# Altium schematic sheet G4-Coral.SchDoc
size A2; Author: Bohao Chu; SheetNumber: 4; SheetTotal: 4
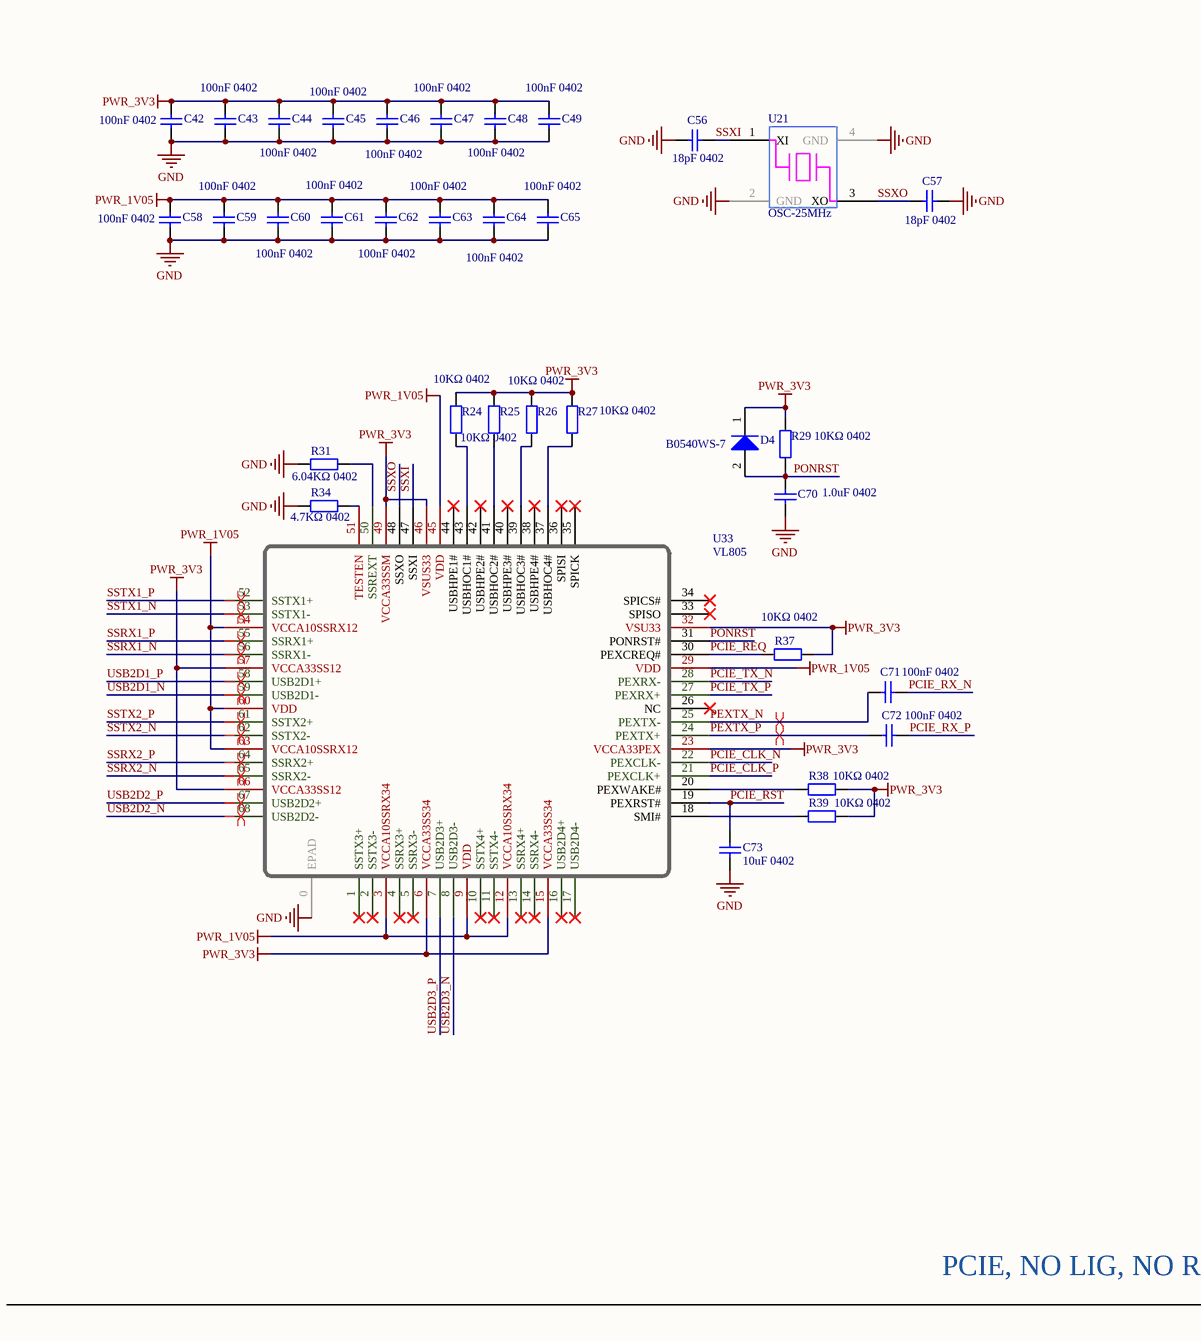
[diagram p0: G4-Coral.SchDoc, left]
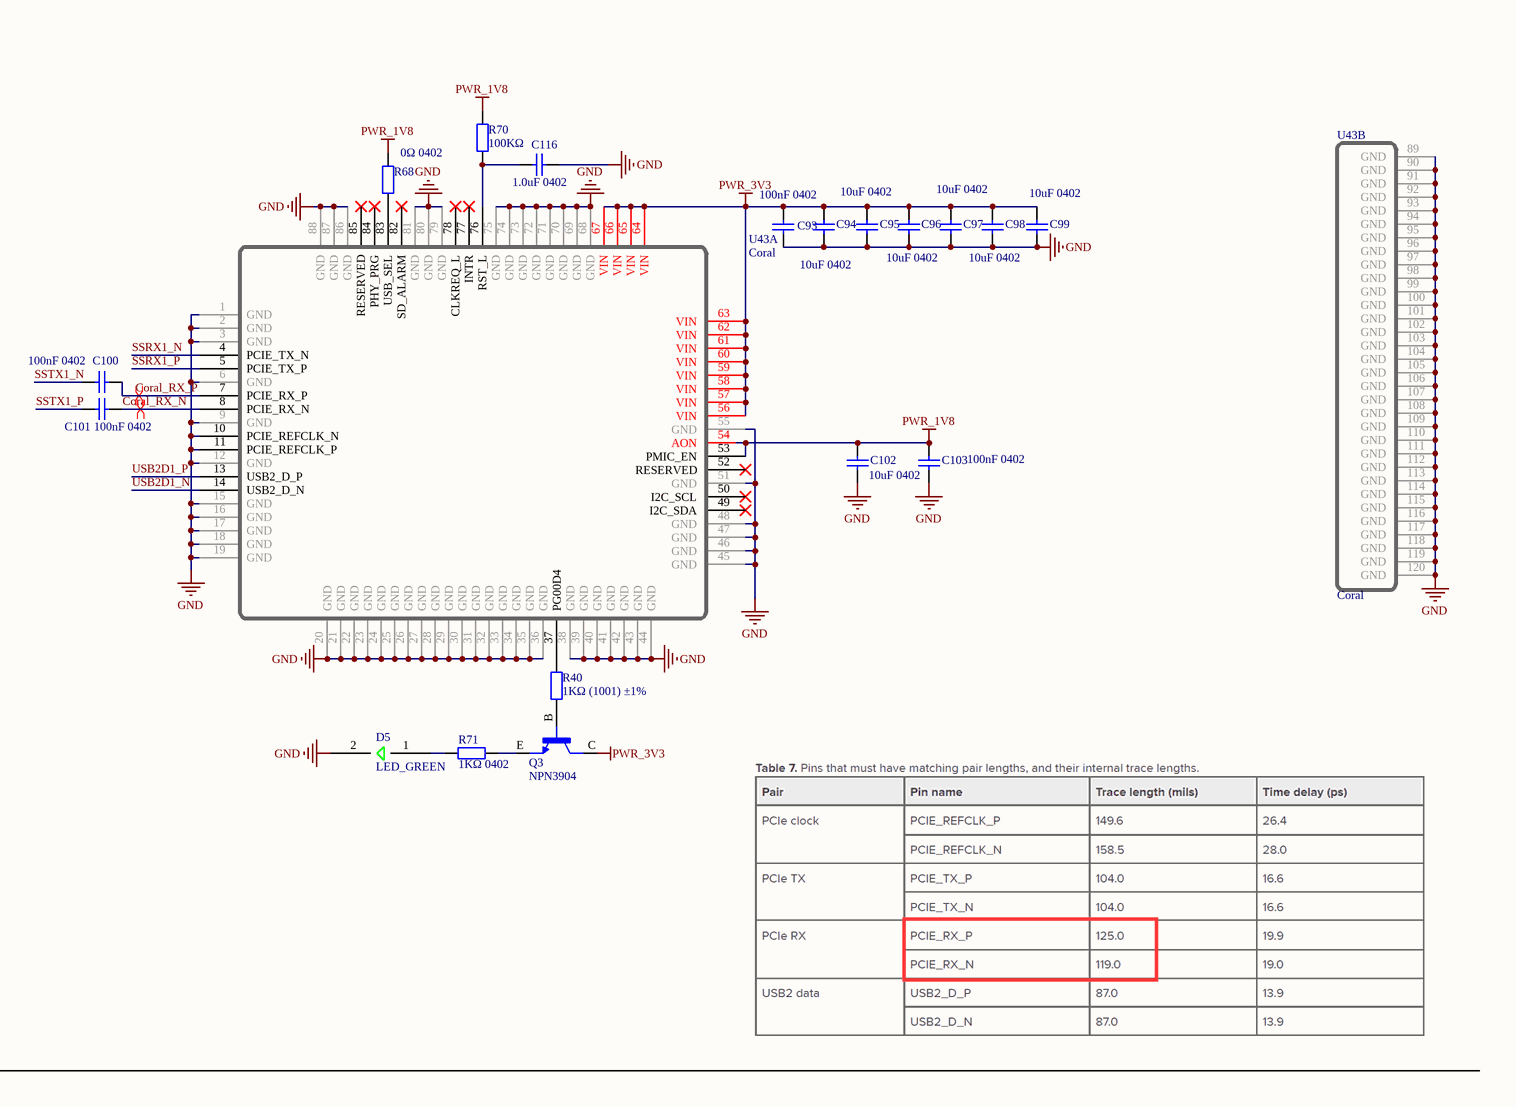
[diagram p1: G4-Coral.SchDoc, right]

## Parts
C42  100nF 0402  [0402_C]
C43  100nF 0402  [0402_C]
C44  100nF 0402  [0402_C]
C45  100nF 0402  [0402_C]
C46  100nF 0402  [0402_C]
C47  100nF 0402  [0402_C]
C48  100nF 0402  [0402_C]
C49  100nF 0402  [0402_C]
C56  18pF 0402  [0402_C]
C57  18pF 0402  [0402_C]
C58  100nF 0402  [0402_C]
C59  100nF 0402  [0402_C]
C60  100nF 0402  [0402_C]
C61  100nF 0402  [0402_C]
C62  100nF 0402  [0402_C]
C63  100nF 0402  [0402_C]
C64  100nF 0402  [0402_C]
C65  100nF 0402  [0402_C]
C70  1.0uF 0402  [0402_C]
C71  100nF 0402  [0402_C]
C72  100nF 0402  [0402_C]
C73  10uF 0402  [0402_C]
C93  100nF 0402  [0402_C]
C94  10uF 0402  [0402_C]
C95  10uF 0402  [0402_C]
C96  10uF 0402  [0402_C]
C97  10uF 0402  [0402_C]
C98  10uF 0402  [0402_C]
C99  10uF 0402  [0402_C]
C100  100nF 0402  [0402_C]
C101  100nF 0402  [0402_C]
C102  10uF 0402  [0402_C]
C103  100nF 0402  [0402_C]
C116  1.0uF 0402  [0402_C]
D4  B0540WS-7  [B0540WS-7]
D5  LED_GREEN  [LED_SIDE]
Q3  NPN3904  [NPN3904]
R24  10KΩ 0402  [0402_R]
R25  10KΩ 0402  [0402_R]
R26  10KΩ 0402  [0402_R]
R27  10KΩ 0402  [0402_R]
R29  10KΩ 0402  [0402_R]
R31  6.04KΩ 0402  [0402_R]
R34  4.7KΩ 0402  [0402_R]
R37  10KΩ 0402  [0402_R]
R38  10KΩ 0402  [0402_R]
R39  10KΩ 0402  [0402_R]
R40  1KΩ (1001) ±1%  [0402_R]
R68  0Ω 0402  [0402_R]
R70  100KΩ  [0402_R]
R71  1KΩ 0402  [0402_R]
U21  OSC-25MHz  [OSC-25MHz]
U33  VL805  [VL805]
U43  Coral  [Coral]  (parts A,B of 2)

## Nets
GND: C42.1 C43.1 C44.1 C45.1 C46.1 C47.1 C48.1 C49.1 C56.1 C57.2 C58.1 C59.1 C60.1 C61.1 C62.1 C63.1 C64.1 C65.1 C70.2 C73.1 C93.1 C94.1 C95.1 C96.1 C97.1 C98.1 C99.1 C102.1 C103.1 C116.1 D5.2 R31.2 R34.2 U21.2(GND) U21.4(GND) U33.0(EPAD) U43.1(GND) U43.2(GND) U43.3(GND) U43.6(GND) U43.9(GND) U43.10(PCIE_REFCLK_N) U43.11(PCIE_REFCLK_P) U43.12(GND) U43.15(GND) U43.16(GND) U43.17(GND) U43.18(GND) U43.19(GND) U43.20(GND) U43.21(GND) U43.22(GND) U43.23(GND) U43.24(GND) U43.25(GND) U43.26(GND) U43.27(GND) U43.28(GND) U43.29(GND) U43.30(GND) U43.31(GND) U43.32(GND) U43.33(GND) U43.34(GND) U43.35(GND) U43.36(GND) U43.38(GND) U43.39(GND) U43.40(GND) U43.41(GND) U43.42(GND) U43.43(GND) U43.44(GND) U43.45(GND) U43.46(GND) U43.47(GND) U43.48(GND) U43.51(GND) U43.55(GND) U43.68(GND) U43.69(GND) U43.70(GND) U43.71(GND) U43.72(GND) U43.73(GND) U43.74(GND) U43.75(GND) U43.79(GND) U43.80(GND) U43.81(GND) U43.86(GND) U43.87(GND) U43.88(GND) U43.89(GND) U43.90(GND) U43.91(GND) U43.92(GND) U43.93(GND) U43.94(GND) U43.95(GND) U43.96(GND) U43.97(GND) U43.98(GND) U43.99(GND) U43.100(GND) U43.101(GND) U43.102(GND) U43.103(GND) U43.104(GND) U43.105(GND) U43.106(GND) U43.107(GND) U43.108(GND) U43.109(GND) U43.110(GND) U43.111(GND) U43.112(GND) U43.113(GND) U43.114(GND) U43.115(GND) U43.116(GND) U43.117(GND) U43.118(GND) U43.119(GND) U43.120(GND)
PWR_1V05: C58.2 C59.2 C60.2 C61.2 C62.2 C63.2 C64.2 C65.2 U33.3(VCCA10SSRX34) U33.9(VDD) U33.12(VCCA10SSRX34) U33.29(VDD) U33.45(VDD) U33.54(VCCA10SSRX12) U33.60(VDD) U33.63(VCCA10SSRX12)
PWR_1V8: C102.2 C103.2 R68.2 R70.2 U43.53(PMIC_EN) U43.54(AON)
PWR_3V3: C42.2 C43.2 C44.2 C45.2 C46.2 C47.2 C48.2 C49.2 C93.2 C94.2 C95.2 C96.2 C97.2 C98.2 C99.2 D4.1(K) Q3.C R24.2 R25.2 R26.2 R27.2 R29.2 R37.2 R38.2 R39.2 U33.6(VCCA33SS34) U33.15(VCCA33SS34) U33.23(VCCA33PEX) U33.32(VSU33) U33.46(VSUS33) U33.49(VCCA33SSM) U33.57(VCCA33SS12) U33.66(VCCA33SS12) U43.56(VIN) U43.57(VIN) U43.58(VIN) U43.59(VIN) U43.60(VIN) U43.61(VIN) U43.62(VIN) U43.63(VIN) U43.64(VIN) U43.65(VIN) U43.66(VIN) U43.67(VIN)
Coral_RX_N: C101.2 U43.8(PCIE_RX_N)
Coral_RX_P: C100.2 U43.7(PCIE_RX_P)
PCIE_CLK_N: U33.22(PEXCLK-)
PCIE_CLK_P: U33.21(PEXCLK+)
PCIE_REQ: R37.1 U33.30(PEXCREQ#)
PCIE_RST: C73.2 U33.19(PEXRST#)
PCIE_RX_N: C71.2
PCIE_RX_P: C72.2
PCIE_TX_N: U33.28(PEXRX-)
PCIE_TX_P: U33.27(PEXRX+)
PEXTX_N: C71.1 U33.25(PEXTX-)
PEXTX_P: C72.1 U33.24(PEXTX+)
PONRST: C70.1 D4.2(A) R29.1 U33.31(PONRST#)
SSRX1_N: U33.56(SSRX1-) U43.4(PCIE_TX_N)
SSRX1_P: U33.55(SSRX1+) U43.5(PCIE_TX_P)
SSRX2_N: U33.65(SSRX2-)
SSRX2_P: U33.64(SSRX2+)
SSTX1_N: C100.1 U33.53(SSTX1-)
SSTX1_P: C101.1 U33.52(SSTX1+)
SSTX2_N: U33.62(SSTX2-)
SSTX2_P: U33.61(SSTX2+)
SSXI: C56.2 U21.1(XI) U33.47(SSXI)
SSXO: C57.1 U21.3(XO) U33.48(SSXO)
USB2D1_N: U33.59(USB2D1-) U43.14(USB2_D_N)
USB2D1_P: U33.58(USB2D1+) U43.13(USB2_D_P)
USB2D2_N: U33.68(USB2D2-)
USB2D2_P: U33.67(USB2D2+)
USB2D3_N: U33.8(USB2D3-)
USB2D3_P: U33.7(USB2D3+)
NetC116_2: C116.2 R70.1 U43.76(RST_L)
NetD5_1: D5.1 R71.1
NetQ3_B: Q3.B R40.1
NetQ3_E: Q3.E R71.2
NetR24_1: R24.1 U33.43(USBHOC1#)
NetR25_1: R25.1 U33.41(USBHOC2#)
NetR26_1: R26.1 U33.39(USBHOC3#)
NetR27_1: R27.1 U33.37(USBHOC4#)
NetR31_1: R31.1 U33.50(SSREXT)
NetR34_1: R34.1 U33.51(TESTEN)
NetR38_1: R38.1 U33.20(PEXWAKE#)
NetR39_1: R39.1 U33.18(SMI#)
NetR40_2: R40.2 U43.37(PG00D4)
NetR68_1: R68.1 U43.83(USB_SEL)

Not connected (* = marked no-connect by the designer): U33 1(SSTX3+)* 2(SSTX3-)* 4(SSRX3+)* 5(SSRX3-)* 10(SSTX4+)* 11(SSTX4-)* 13(SSRX4+)* 14(SSRX4-)* 16(USB2D4+)* 17(USB2D4-)* 26(NC)* 33(SPISO)* 34(SPICS#)* 35(SPICK)* 36(SPISI)* 38(USBHPE4#)* 40(USBHPE3#)* 42(USBHPE2#)* 44(USBHPE1#)*; U43 49(I2C_SDA)* 50(I2C_SCL)* 52(RESERVED)* 77(INTR)* 78(CLKREQ_L)* 82(SD_ALARM)* 84(PHY_PRG)* 85(RESERVED)*

## Layout directives
differential pair: Coral_RX_N, Coral_RX_P, PEXTX_N, PEXTX_P, SSRX1_N, SSRX1_P, SSRX2_N, SSRX2_P, SSTX1_N, SSTX1_P, SSTX2_N, SSTX2_P, USB2D1_N, USB2D1_P, USB2D2_N, USB2D2_P

## Notes on the sheet
- PCIE, NO LIG, NO RES, OK

## Library data of the parts
C42-C49 C58-C65 C71 C72 C93 C100 C101 C103 = 0402 100nF (104) 10% 16V: 贴片电容; ComponentLink1Description: 供应商链接; ComponentLink1URL: http://www.szlcsc.com/product/details_1877.html; Package: 0402; Supplier: LC; SuppliersPartNumber: C1525
C56 C57 = 0402 18pF (180) 5% 50V: 贴片电容; ComponentLink1Description: 供应商链接; ComponentLink1URL: http://www.szlcsc.com/product/details_1901.html; Package: 0402; Supplier: LC; SuppliersPartNumber: C1549
C70 C116 = 0402 1.0uF (105) 10% 25V: 贴片电容; ComponentLink1Description: 供应商链接; ComponentLink1URL: http://www.szlcsc.com/product/details_53938.html; Package: 0402; Supplier: LC; SuppliersPartNumber: C52923
C73 C94-C99 C102 = 0402 10uF (106) 20% 6.3V: 贴片电容; ComponentLink1Description: 供应商链接; ComponentLink1URL: http://www.szlcsc.com/product/details_16204.html; Package: 0402; Supplier: LC; SuppliersPartNumber: C15525
D5 = LED_GREEN: LED GREEN 0603 SIDE
Q3 = NPN3904: NPN 40V 200mA 300MHz 300mW Surface; MF: ON Semiconductor; MP: MMBT3904LT1G; Value: *; Package: SOT-23-3 NXP Semiconductors; SnapEDA_Link: https://www.snapeda.com/parts/MMBT3904LT1G/ON%20Semiconductor/view-part/587490/?ref=snap; Price: None; Availability: Unavailable
R24-R27 R29 R37-R39 = 0402 10KΩ (1002) 1%: 贴片电阻; ComponentLink1Description: 供应商链接; ComponentLink1URL: http://www.szlcsc.com/product/details_26487.html; Package: 0402; Supplier: LC; SuppliersPartNumber: C25744
R31 = 0402 5.6KΩ (5601) 1%: 贴片电阻; ComponentLink1Description: 供应商链接; ComponentLink1URL: http://www.szlcsc.com/product/details_26651.html; Package: 0402; Supplier: LC; SuppliersPartNumber: C25908
R34 = 0402 4.7KΩ (4701) 1%: 贴片电阻; ComponentLink1Description: 供应商链接; ComponentLink1URL: http://www.szlcsc.com/product/details_26643.html; Package: 0402; Supplier: LC; SuppliersPartNumber: C25900
R40 R71 = 0402 1KΩ (1001) 1%: 贴片电阻; ComponentLink1Description: 供应商链接; ComponentLink1URL: http://www.szlcsc.com/product/details_12256.html; Package: 0402; Supplier: LC; SuppliersPartNumber: C11702
R68 = 0402 0Ω (0R0) 1%: 贴片电阻; ComponentLink1Description: 供应商链接; ComponentLink1URL: http://www.szlcsc.com/product/details_17853.html; Package: 0402; Supplier: LC; SuppliersPartNumber: C17168
R70 = 0402 100KΩ (1003) 1%: 贴片电阻; ComponentLink1Description: 供应商链接; ComponentLink1URL: http://www.szlcsc.com/product/details_26484.html; Package: 0402; Supplier: LC; SuppliersPartNumber: C25741
U21 = OSC-25MHz: Passive crystal oscillator
U33 = VL805: PCIe to USB3.0
U43 = Coral: G313-06329-00